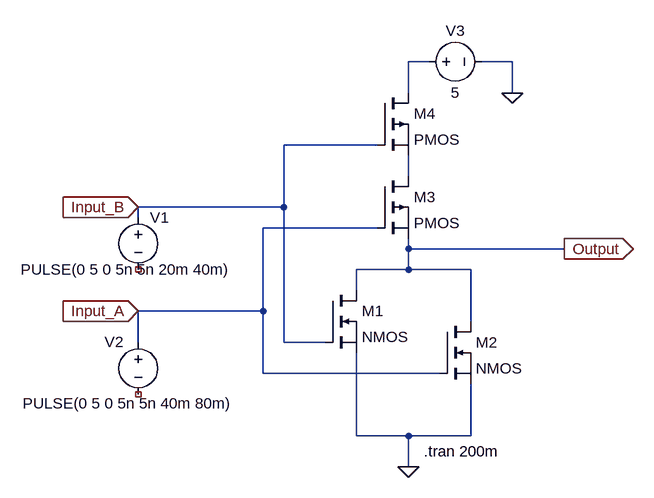
[diagram p0: schematic Nor_gate.asc]
Nor_gate.asc, the LTspice schematic file:
Version 4
SHEET 1 880 680
WIRE 320 -144 288 -144
WIRE 448 -144 400 -144
WIRE 288 -96 288 -144
WIRE 448 -96 448 -144
WIRE 240 -16 96 -16
WIRE 288 32 288 0
WIRE 96 80 96 -16
WIRE 96 80 -128 80
WIRE -128 96 -128 80
WIRE 240 112 64 112
WIRE 288 144 288 128
WIRE 528 144 288 144
WIRE 288 176 288 144
WIRE 288 176 208 176
WIRE 384 176 288 176
WIRE 208 208 208 176
WIRE 64 240 64 112
WIRE 64 240 -128 240
WIRE 384 256 384 176
WIRE -128 288 -128 240
WIRE 96 288 96 80
WIRE 160 288 96 288
WIRE 64 336 64 240
WIRE 336 336 64 336
WIRE 208 432 208 304
WIRE 288 432 208 432
WIRE 384 432 384 352
WIRE 384 432 288 432
WIRE 288 480 288 432
FLAG 288 480 0
FLAG 448 -96 0
FLAG 528 144 Output
IOPIN 528 144 Out
FLAG -128 80 Input_B
IOPIN -128 80 In
FLAG -128 240 Input_A
IOPIN -128 240 In
SYMBOL nmos 160 208 R0
SYMATTR InstName M1
SYMBOL nmos 336 256 R0
SYMATTR InstName M2
SYMBOL pmos 240 32 R0
SYMATTR InstName M3
SYMBOL pmos 240 -96 R0
SYMATTR InstName M4
SYMBOL voltage -128 80 R0
WINDOW 0 18 16 Left 2
WINDOW 3 -181 96 Left 2
WINDOW 123 0 0 Left 0
WINDOW 39 0 0 Left 0
SYMATTR InstName V1
SYMATTR Value PULSE(0 5 0 5n 5n 20m 40m)
SYMBOL voltage -128 272 R0
WINDOW 0 -52 15 Left 2
WINDOW 3 -178 110 Left 2
SYMATTR InstName V2
SYMATTR Value PULSE(0 5 0 5n 5n 40m 80m)
SYMBOL voltage 304 -144 R270
WINDOW 0 32 56 VTop 2
WINDOW 3 -32 56 VBottom 2
WINDOW 123 0 0 Left 0
WINDOW 39 0 0 Left 0
SYMATTR InstName V3
SYMATTR Value 5
TEXT 312 456 Left 2 !.tran 200m

The netlist it stands for:
* Nor_gate.asc
M1 Output Input_B 0 0 NMOS
M2 Output Input_A 0 0 NMOS
M3 N002 Input_A Output Output PMOS
M4 N001 Input_B N002 N002 PMOS
V1 Input_B NC_01 PULSE(0 5 0 5n 5n 20m 40m)
V2 Input_A NC_02 PULSE(0 5 0 5n 5n 40m 80m)
V3 N001 0 5
.model NMOS NMOS
.model PMOS PMOS
.lib standard.mos
.tran 200m
.backanno
.end